# EAGLE schematic LCD (EAGLE 8.2.1)
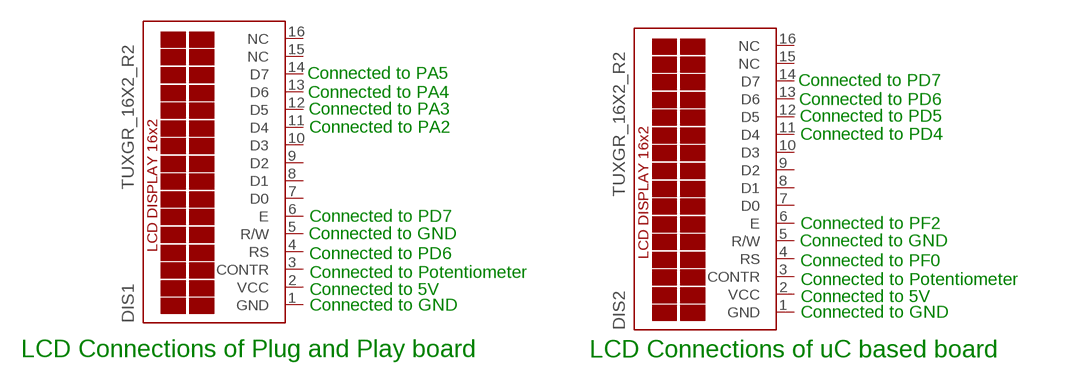
[diagram p0: schematic, sheet 1]

## Parts
DIS1  TUXGR_16X2_R2  [TUXGR_16X2_R2]
DIS2  TUXGR_16X2_R2  [TUXGR_16X2_R2]
Unconnected: DIS1.3(CONTR) DIS1.4(RS) DIS1.5(R/W) DIS1.6(E) DIS1.7(D0) DIS1.8(D1) DIS1.9(D2) DIS1.10(D3) DIS1.11(D4) DIS1.12(D5) DIS1.13(D6) DIS1.14(D7) DIS1.15(NC) DIS1.16(NC) DIS2.3(CONTR) DIS2.4(RS) DIS2.5(R/W) DIS2.6(E) DIS2.7(D0) DIS2.8(D1) DIS2.9(D2) DIS2.10(D3) DIS2.11(D4) DIS2.12(D5) DIS2.13(D6) DIS2.14(D7) DIS2.15(NC) DIS2.16(NC)

## Notes on the sheet
- Connected to PA5
- Connected to PD7
- Connected to PA4
- Connected to PD6
- Connected to PA3
- Connected to PD5
- Connected to PA2
- Connected to PD4
- Connected to PD7
- Connected to PF2
- Connected to GND
- Connected to GND
- Connected to PD6
- Connected to PF0
- Connected to Potentiometer
- Connected to Potentiometer
- Connected to 5V
- Connected to 5V
- Connected to GND
- Connected to GND
- LCD Connections of Plug and Play board | LCD Connections of uC based board

## Power pins joined to a net without a drawn wire
GND: DIS1.1(GND) DIS2.1(GND)
VCC: DIS1.2(VCC) DIS2.2(VCC)

## Library data of the parts
DIS1 DIS2 = display-lcd:TUXGR_16X2_R2: Tuxgraphics LCD display 16x2 characters reflective, without background light Source: tuxgr_12x2_r2.pdf; OC_FARNELL: unknown; OC_NEWARK: unknown